# EAGLE design METEOR2K17_final (EAGLE 8.2.2)
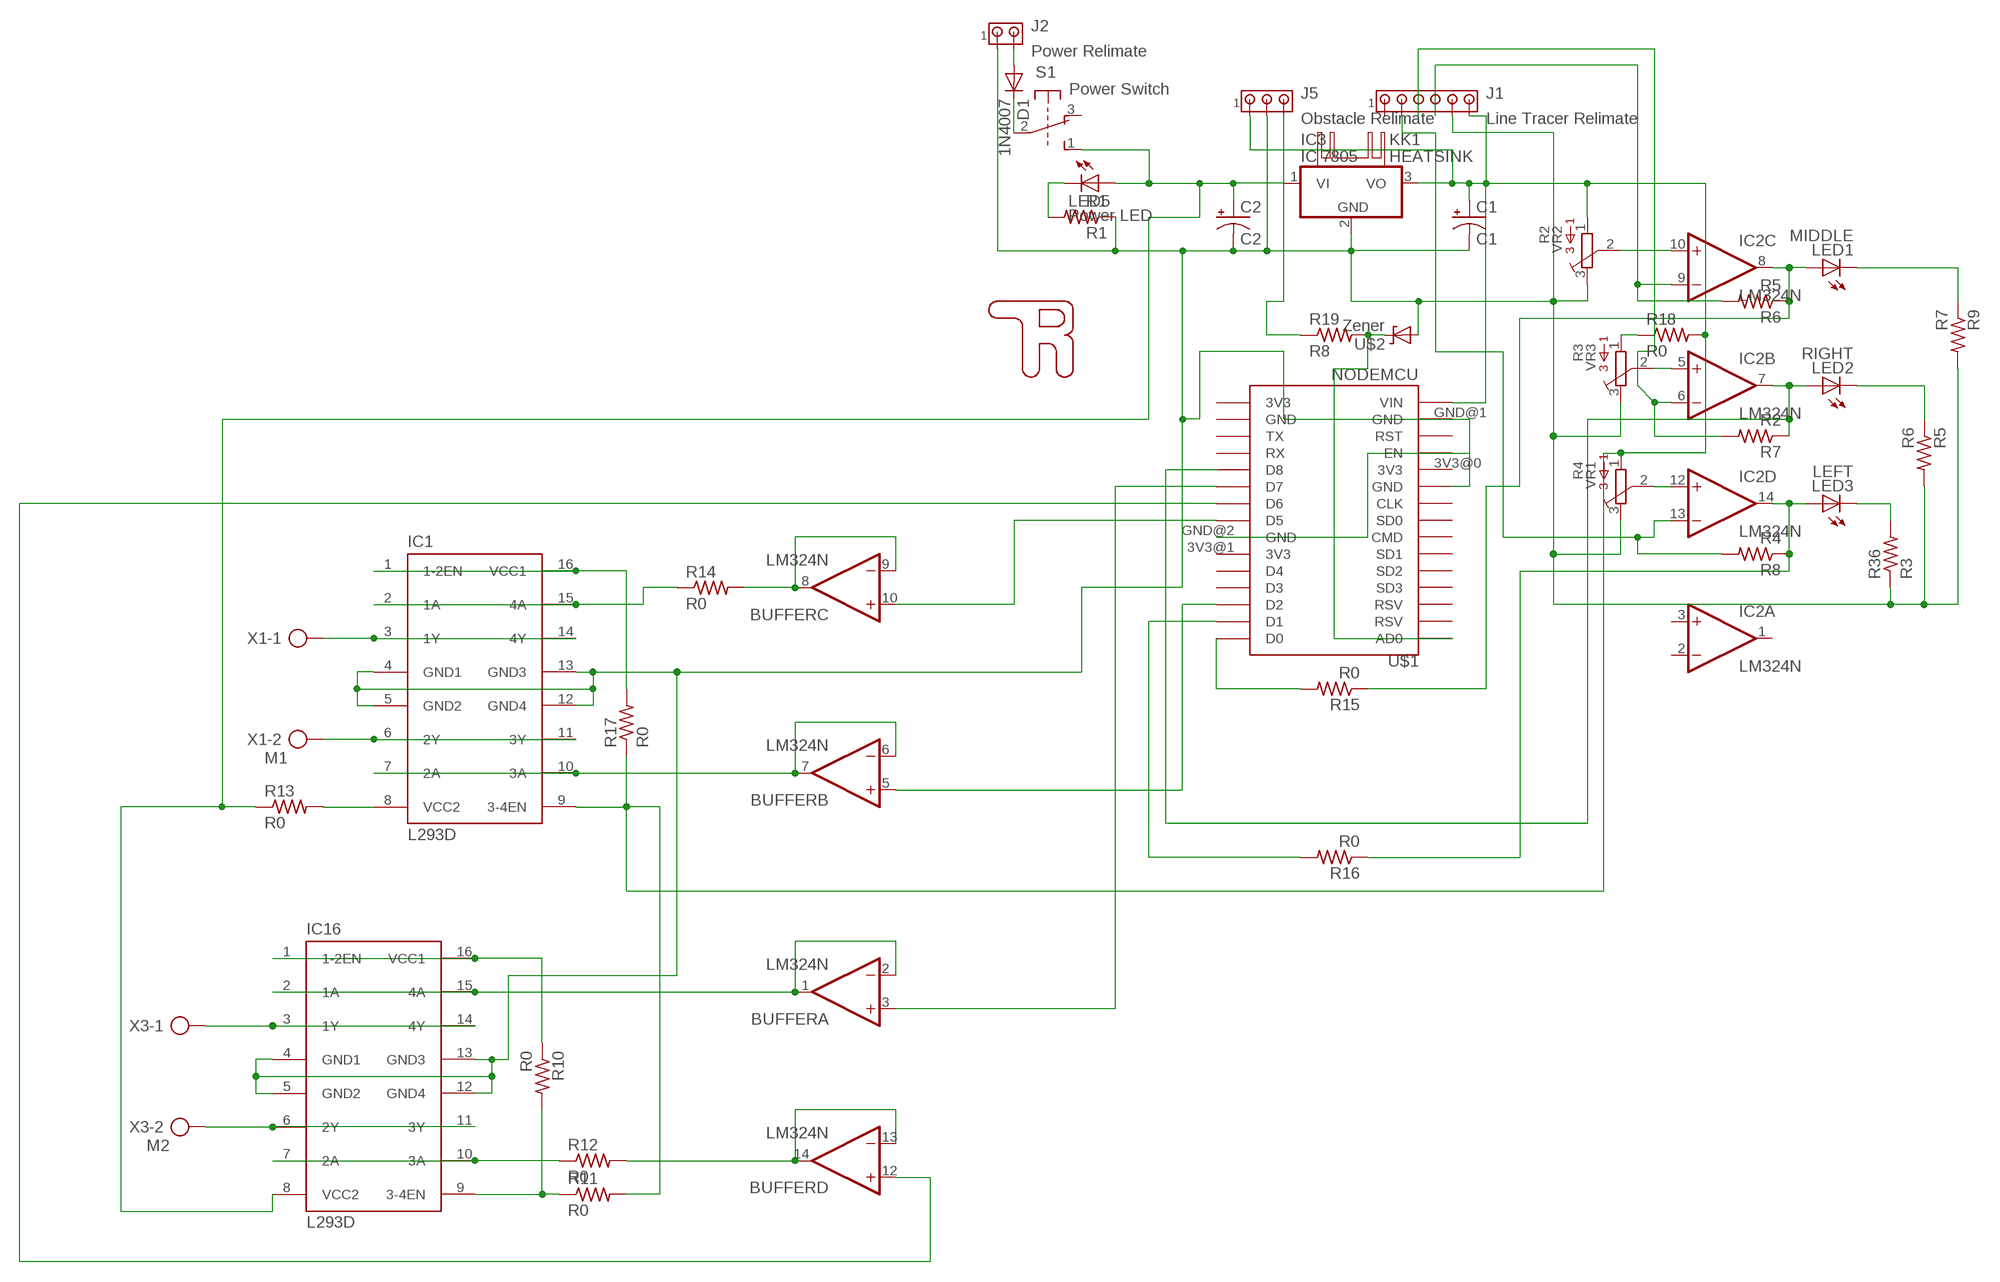
[diagram p0: schematic, sheet 1]

## Parts
BUFFER  LM324N  [DIL14]
C1  C1  1000UF-RADIAL-5MM-25V-20%  [CPOL-RADIAL-5MM-10MM]
C2  C2  CPOL-USE3.5-8  [E3,5-8]
D1  1N4007  1N4004  [DO41-10]
IC1  L293D  [DIL16]
IC2  LM324N  [DIL14]
IC3  IC 7805  7805TV  [TO220V]
IC16  L293D  [DIL16]
J1  Line Tracer Relimate  MTA06-100  [10X06MTA]
J2  Power Relimate  MTA02-100  [10X02MTA]
J5  Obstacle Relimate  MTA03-100  [10X03MTA]
KK1  HEATSINK  [HEATSINK]
LED1  MIDDLE  LED3MM  [LED3MM]
LED2  RIGHT  LED3MM  [LED3MM]
LED3  LEFT  LED3MM  [LED3MM]
LED5  Power LED  LED3MM  [LED3MM]
R1  R1  R-US_0204/7  [0204/7]
R2  VR2  3386-W  [3386W]
R3  VR3  3386-W  [3386W]
R4  VR1  3386-W  [3386W]
R5  R6  R-US_0204/7  [0204/7]
R6  R5  R-US_0204/7  [0204/7]
R7  R2  R-US_0204/7  [0204/7]
R8  R4  R-US_0204/7  [0204/7]
R9  R7  R-US_0204/7  [0204/7]
R10  R0  R-US_0204/7  [0204/7]
R11  R0  R-US_0204/7  [0204/7]
R12  R0  R-US_0207/10  [0207/10]
R13  R0  R-US_0204/7  [0204/7]
R14  R0  R-US_0207/12  [0207/12]
R15  R0  R-US_0204/7  [0204/7]
R16  R0  R-US_0204/7  [0204/7]
R17  R0  R-US_0204/7  [0204/7]
R18  R0  R-US_0204/7  [0204/7]
R19  R8  R-US_0204/7  [0204/7]
R36  R3  R-US_0204/7  [0204/7]
S1  Power Switch  9077-2  [9077-2]
U$1  NODEMCU  NODEMCU_V20  [NODEMCU_HSILK]
U$2  Zener  DIODE-ZENERPTH  [DIODE-ZENER]
U$3  TRLOGO  [TRLOGO]
X1  M1  AK300/2  [AK300/2]
X3  M2  AK300/2  [AK300/2]

## Nets
5V: C1.+ IC1.1(1-2EN) IC1.9(3-4EN) IC1.16(VCC1) IC3.3(VO) IC16.1(1-2EN) IC16.9(3-4EN) IC16.16(VCC1) J1.1 J5.1 R2.1 R4.1 R10.1 R10.2 R11.1 R11.2 R17.1 R17.2 R18.2 U$1.VIN
12V: C2.+ IC1.8(VCC2) IC3.1(VI) IC16.8(VCC2) LED5.A R13.1 R13.2 S1.1(1:S)
-LED3: LED3.K(C) R36.2
GND: C1.- C2.- IC1.4(GND1) IC1.5(GND2) IC1.12(GND4) IC1.13(GND3) IC3.2(GND) IC16.4(GND1) IC16.5(GND2) IC16.12(GND4) IC16.13(GND3) J1.2 J2.1 J5.2 R1.1 R2.3 R3.3 R4.3 R5.2 R9.2 R36.1 U$1.GND@0(GND) U$1.GND@2(GND) U$2.P$2(A)
N$1: IC2.6(B:-IN) J1.4 R7.2
N$2: D1.A J2.2
N$3: IC2.12(D:+IN) R4.2
N$4: J5.3 R19.1
N$5: IC2.7(B:OUT) LED2.A R7.1 U$1.D8
N$6: LED5.K(C) R1.2
N$7: IC1.2(1A) IC1.15(4A) R14.1
N$8: IC2.14(D:OUT) LED3.A R8.1 R16.1
N$9: IC1.3(1Y) IC1.14(4Y) X1.1
N$10: IC1.6(2Y) IC1.11(3Y) X1.2
N$11: D1.C S1.2(1:P)
N$13: R3.1 R18.1
N$15: BUFFER.6(B:-IN) BUFFER.7(B:OUT) IC1.7(2A) IC1.10(3A)
N$16: IC2.8(C:OUT) LED1.A R6.1 R15.1
N$17: R19.2 U$1.AD0 U$2.P$1(C)
N$18: BUFFER.13(D:-IN) BUFFER.14(D:OUT) R12.2
N$19: IC2.10(C:+IN) R2.2
N$20: BUFFER.10(C:+IN) U$1.D5
N$21: IC2.5(B:+IN) R3.2
N$22: BUFFER.5(B:+IN) U$1.D2
N$24: BUFFER.3(A:+IN) U$1.D7
N$25: IC16.7(2A) IC16.10(3A) R12.1
N$27: IC2.9(C:-IN) J1.3 R6.2
N$28: IC2.13(D:-IN) J1.5 R8.2
N$29: LED1.K(C) R9.1
N$30: LED2.K(C) R5.1
N$31: BUFFER.8(C:OUT) BUFFER.9(C:-IN) R14.2
N$32: IC16.3(1Y) IC16.14(4Y) X3.1
N$33: BUFFER.12(D:+IN) U$1.D6
N$34: BUFFER.1(A:OUT) BUFFER.2(A:-IN) IC16.2(1A) IC16.15(4A)
N$35: IC16.6(2Y) IC16.11(3Y) X3.2
N$36: R15.2 U$1.D0
N$37: R16.2 U$1.D1
Unconnected: IC2.1(A:OUT) IC2.2(A:-IN) IC2.3(A:+IN) J1.6 S1.3(1:O) S1.4(2:S) S1.5(2:P) S1.6(2:O) U$1.3V3@0(3V3) U$1.3V3@1(3V3) U$1.3V3@2(3V3) U$1.CLK U$1.CMD U$1.D3 U$1.D4 U$1.EN U$1.GND@1(GND) U$1.GND@3(GND) U$1.RST U$1.RSV@0(RSV) U$1.RSV@1(RSV) U$1.RX U$1.SD0 U$1.SD1 U$1.SD2 U$1.SD3 U$1.TX

## Power pins joined to a net without a drawn wire
5V: BUFFER.4(P:V+) IC2.4(P:V+)
GND: BUFFER.11(P:V-) IC2.11(P:V-)

## Library data of the parts
BUFFER IC2 = linear:LM324: OP AMP
C1 = SparkFun-Capacitors:1000UF: 1,000µF/1mF ceramic capacitors A capacitor is a passive two-terminal electrical component used to store electrical energy temporarily in an electric field. CAP-08070; PROD_ID: CAP-09538; VALUE: 1mF
C2 = adafruit:CPOL-US: POLARIZED CAPACITOR, American symbol
D1 = adafruit:1N4004: DIODE General purpose 1N400x type rectifier (With bigger pads) http://www.ladyada.net/library/pcb/eaglelibrary.html
IC1 IC16 = st-microelectronics:L293D: PUSH-PULL 4 CHANNEL DRIVER; MPN: L293D; OC_FARNELL: 9589619; OC_NEWARK: 56P8249
IC3 = linear:78*: Positive VOLTAGE REGULATOR Source: http://cache.national.com/ds/LM/LM78L05.pdf http://www.fairchildsemi.com/ds/LM/LM7805.pdf
J1 = con-amp:MTA06-100: AMP connector
J2 = con-amp:MTA02-100: AMP connector
J5 = con-amp:MTA03-100: AMP connector
KK1 = heatsink:HEATSINK: Made by Aniruddha Damle (TRSKNCOE)
LED1-LED3 LED5 = adafruit:LED: LED OSRAM: - CHIPLED LG R971, LG N971, LY N971, LG Q971, LY Q971, LO R971, LY R971 LH N974, LH R974 LS Q976, LO Q976, LY Q976 LO Q996 - Hyper CHIPLED LW Q18S LB Q993, LB Q99A, LB R99A - SideLED LS A670, LO A670, LY A670, LG A670, LP A670 LB A673, LV A673, LT A673, LW A673 LH A674 LY A675 LS A676, LA A676, LO A676, LY A676, LW A676 LS A679, LY A679, LG A679 - Hyper Micro SIDELED® LS Y876, LA Y876, LO Y876, LY Y876 LT Y87S - SmartLED LW L88C, LW L88S LB L89C, LB L89S, LG L890 LS L89K, LO L89K, LY L89K LS L896, LA L896, LO L896, LY L896 - TOPLED LS T670, LO T670, LY T670, LG T670, LP T670 LSG T670, LSP T670, LSY T670, LOP T670, LYG T670 LG T671, LOG T671, LSG T671 LB T673, LV T673, LT T673, LW T673 LH T674 LS T676, LA T676, LO T676, LY T676, LB T676, LH T676, LSB T676, LW T676 LB T67C, LV T67C, LT T67C, LS T67K, LO T67K, LY T67K, LW E67C LS E67B, LA E67B, LO E67B, LY E67B, LB E67C, LV E67C, LT E67C LW T67C LS T679, LY T679, LG T679 LS T770, LO T770, LY T770, LG T770, LP T770 LB T773, LV T773, LT T773, LW T773 LH T774 LS E675, LA E675, LY E675, LS T675 LS T776, LA T776, LO T776, LY T776, LB T776 LHGB T686 LT T68C, LB T68C - Hyper Mini TOPLED® LB M676 - Mini TOPLED Santana® LG M470 LS M47K, LO M47K, LY M47K Source: http://www.osram.convergy.de/
R1 R5-R19 R36 = adafruit:R-US_: RESISTOR, American symbol
R2-R4 = bourns:3386-: 3386 Series 3/8" Square Trimmer
S1 = switch-misc:9077-2: MARQUARDT SWITCH 9077.0200 Distributor: Buerklin <https://www.buerklin.com/default.asp?event=ShowArtikel%2812G2822%29&l=d&jump=ArtNr_12G2822>
U$1 = NODEMCU:NODEMCU_V2
U$2 = SparkFun:DIODE-ZENER: Zener Diode Production Part - 8199 3.4V Zener Voltage
U$3 = TRLOGO:TRLOGO
X1 X3 = con-ptr500:AK300/2: CONNECTOR; OC_FARNELL: unknown; OC_NEWARK: unknown

## Board
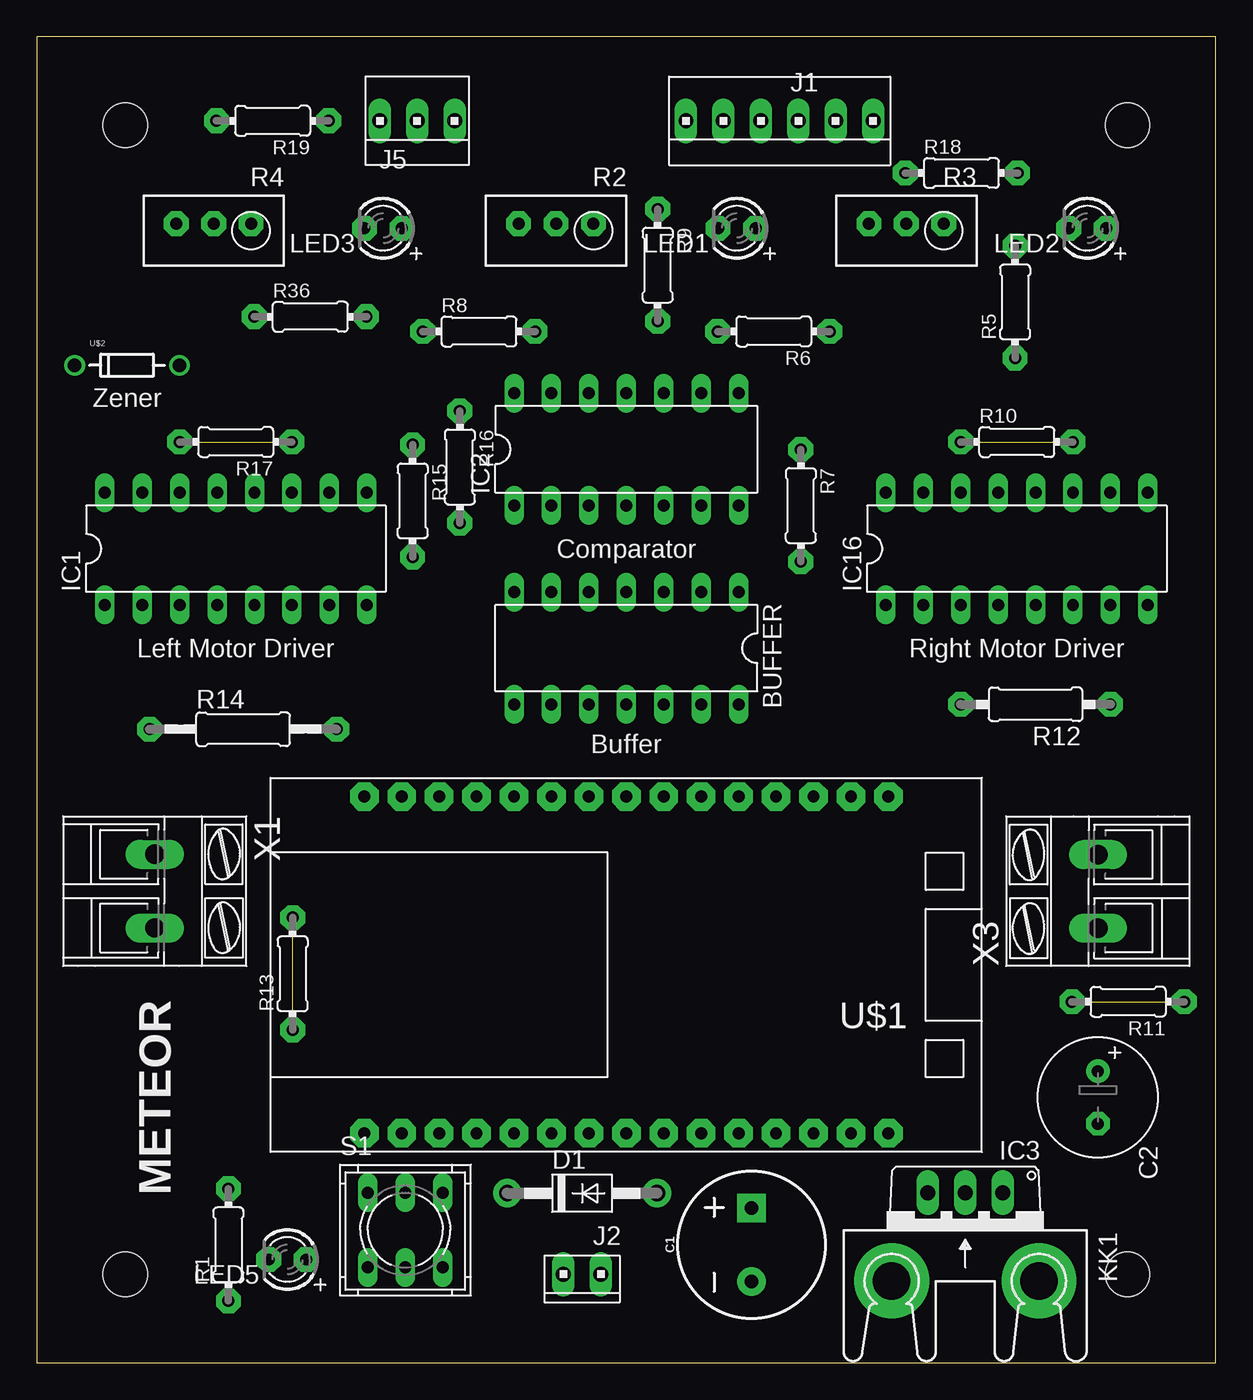
[diagram p1: board, top side]
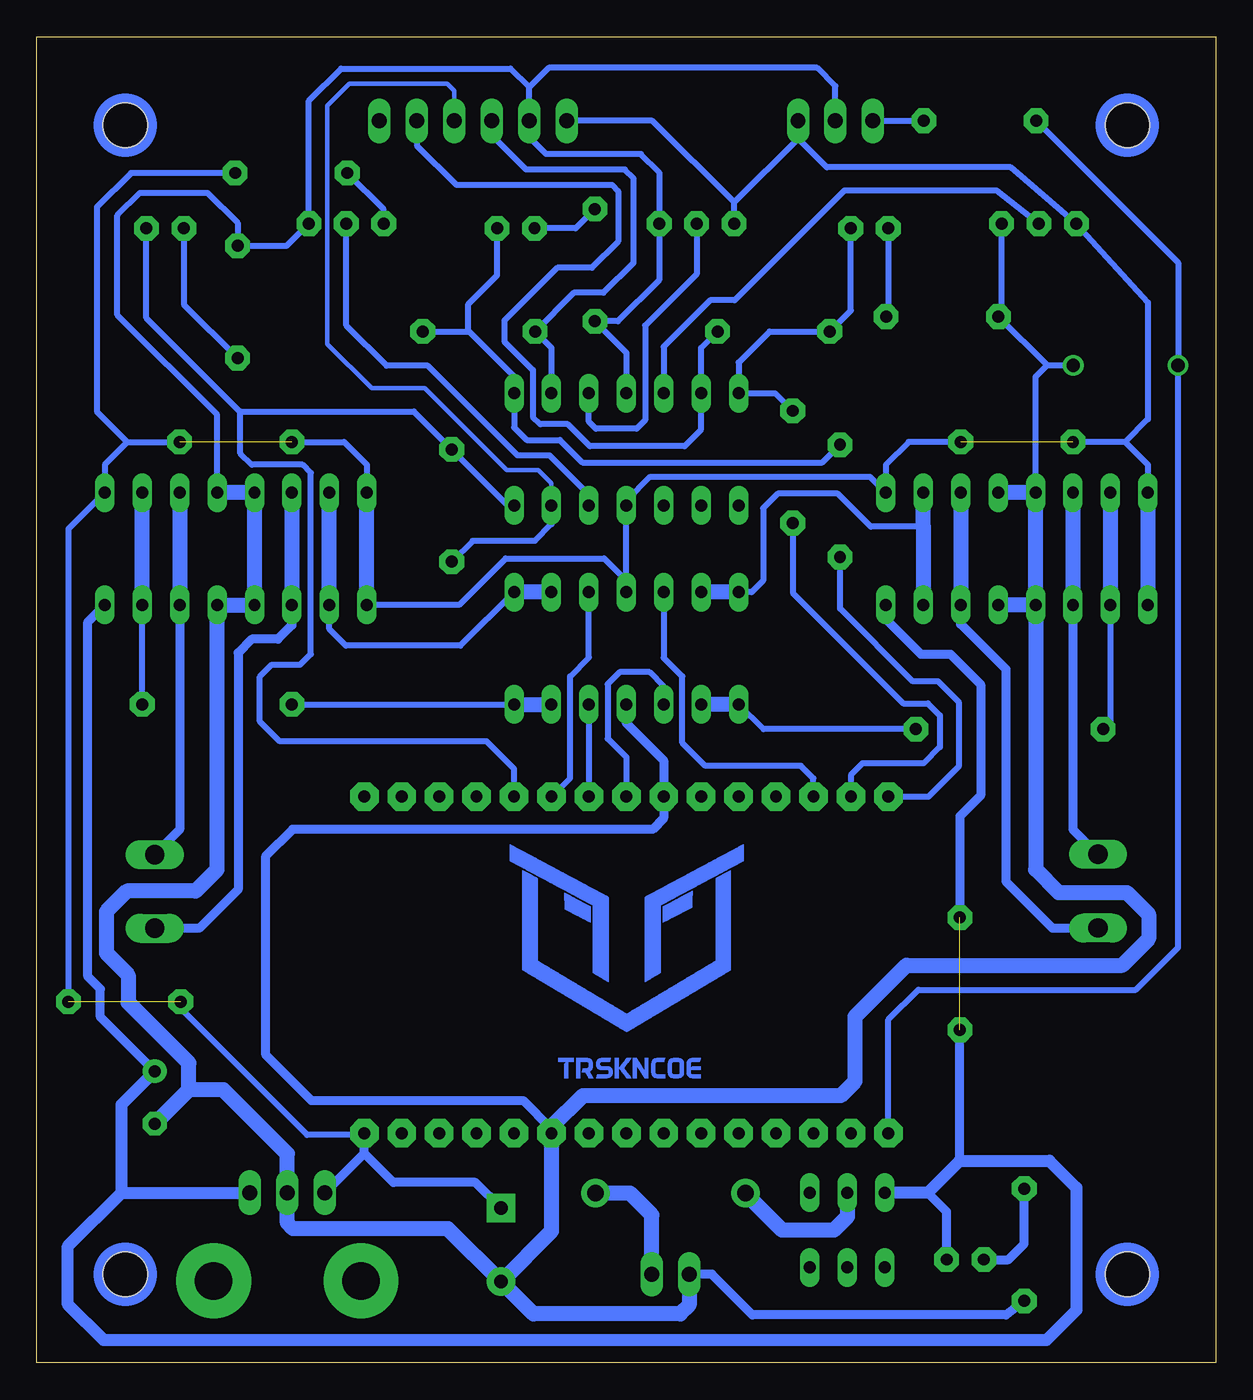
[diagram p2: board, bottom side, seen from below]

Size 80 x 90 mm. Coordinates in mm from the lower left corner, seen from the top.
Outline: 0,0 80,0 80,90 0,90 0,0
Copper layers (1*16): Top 0.035mm / dielectric 1.5mm / Bottom 0.035mm
Design rules "default *": minimum track width 10mil, minimum drill 24mil, track to track 8mil, track to pad 6mil, pad to pad 8mil, via to via 8mil, smd to smd 8mil, copper to edge 40mil, drill to drill 8mil, minimum pad ring 10mil, minimum via ring 8mil, stop-mask expansion 4mil, vias tented up to drill 0mil, thermal gap 10mil
Holes 3 mm at 6,84 74,84 74,6 6,6

### Footprints (pad centres in the part's own frame; a part is rotated, then mirrored left to right if it is on the bottom)
DIL14 = drill 0.813 long: 1 -7.62,-3.81; 2 -5.08,-3.81; 3 -2.54,-3.81; 4 0,-3.81; 5 2.54,-3.81; 6 5.08,-3.81; 7 7.62,-3.81; 8 7.62,3.81; 9 5.08,3.81; 10 2.54,3.81; 11 0,3.81; 12 -2.54,3.81; 13 -5.08,3.81; 14 -7.62,3.81
CPOL-RADIAL-5MM-10MM = drill 0.9 pad 1.93 square: + 2.5,0 | drill 0.9 pad 1.93: - -2.5,0
E3,5-8 = drill 0.813 pad 1.6: + -1.778,0 | drill 0.813 pad 1.6 octagon: - 1.778,0
DO41-10 = drill 1.118 pad 1.93: A 5.08,0; C -5.08,0
DIL16 = drill 0.813 long: 1 -8.89,-3.81; 2 -6.35,-3.81; 3 -3.81,-3.81; 4 -1.27,-3.81; 5 1.27,-3.81; 6 3.81,-3.81; 7 6.35,-3.81; 8 8.89,-3.81; 9 8.89,3.81; 10 6.35,3.81; 11 3.81,3.81; 12 1.27,3.81; 13 -1.27,3.81; 14 -3.81,3.81; 15 -6.35,3.81; 16 -8.89,3.81
TO220V = drill 1.016 long: 1 -2.54,-2.54; 2 0,-2.54; 3 2.54,-2.54
10X06MTA = drill 1.016 long: 1 6.35,0; 2 3.81,0; 3 1.27,0; 4 -1.27,0; 5 -3.81,0; 6 -6.35,0
10X02MTA = drill 1.016 long: 1 1.27,0; 2 -1.27,0
10X03MTA = drill 1.016 long: 1 2.54,0; 2 0,0; 3 -2.54,0
HEATSINK = drill 2.54 pad 5.08: A2,5 -5,3.45; B2,5 5,3.45
LED3MM = drill 0.813 pad 1.676 octagon: A -1.27,0; K 1.27,0
0204/7 = drill 0.813 pad 1.676 octagon: 1 -3.81,0; 2 3.81,0
3386W = drill 0.813 pad 1.676 octagon: 1 2.54,-0.318; 2 0,-0.318; 3 -2.54,-0.318
0207/10 = drill 0.813 pad 1.676 octagon: 1 -5.08,0; 2 5.08,0
0207/12 = drill 0.813 pad 1.676 octagon: 1 -6.35,0; 2 6.35,0
9077-2 = drill 0.813 long: 1 -2.54,2.54; 2 0,2.54; 3 2.54,2.54; 4 -2.54,-2.54; 5 0,-2.54; 6 2.54,-2.54
NODEMCU_HSILK = drill 0.8 pad 1.93 octagon: 3V3@0 -11.43,-7.62; 3V3@1 11.43,5.08; 3V3@2 11.43,-17.78; AD0 -11.43,17.78; CLK -11.43,-2.54; CMD -11.43,2.54; D0 11.43,17.78; D1 11.43,15.24; D2 11.43,12.7; D3 11.43,10.16; D4 11.43,7.62; D5 11.43,0; D6 11.43,-2.54; D7 11.43,-5.08; D8 11.43,-7.62; EN -11.43,-10.16; GND@0 -11.43,-5.08; GND@1 -11.43,-15.24; GND@2 11.43,2.54; GND@3 11.43,-15.24; RST -11.43,-12.7; RSV@0 -11.43,15.24; RSV@1 -11.43,12.7; RX 11.43,-10.16; SD0 -11.43,0; SD1 -11.43,5.08; SD2 -11.43,7.62; SD3 -11.43,10.16; TX 11.43,-12.7; VIN -11.43,-17.78
DIODE-ZENER = drill 0.9: P$1 -3.556,0; P$2 3.556,0
AK300/2 = drill 1.321 long: 1 -2.515,0; 2 2.489,0

### Placement (x,y rotation side)
BUFFER  40,48.5 180 top
C1  48.5,8 90 top
C2  72,18 270 top
D1  37,11.5 0 top
IC1  13.5,55.25 0 top
IC2  40,62 0 top
IC3  63,9 180 top
IC16  66.5,55.25 0 top
J1  50.4,84.3 180 top
J2  37,6 180 top
J5  25.81,84.3 0 top
KK1  63,9 180 top
LED1  47.5,77 180 top
LED2  71.29,77 180 top
LED3  23.5,77 180 top
LED5  17,7 180 top
R1  13,8 90 top
R2  35.23,77 180 top
R3  59,77 180 top
R4  12,77 180 top
R5  66.38,72 90 top
R6  50,70 180 top
R7  51.84,58.18 270 top
R8  30,70 0 top
R9  42.13,74.5 270 top
R10  66.5,62.5 0 top
R11  74.05,24.5 180 top
R12  67.77,44.69 180 top
R13  17.36,26.4 90 top
R14  14,43 0 top
R15  25.5,58.5 270 top
R16  28.7,60.8 270 top
R17  13.5,62.5 180 top
R18  62.74,80.76 0 top
R19  16,84.3 180 top
R36  18.56,71 0 top
S1  25,9 0 top
U$1  40,27 90 top
U$2  6.12,67.7 0 top
U$3  40,27.25 0 top
X1  8,32 270 top
X3  72,32 90 top

### Tracks (layer width: path | path; a pad name or v marks a point on that pad's centre or on a via)
5V  (3 unrouted)
  Bottom 0.406: IC2.4 40,53.1 41.5,54.6 48.19,54.6 51.35,51.44 IC16.1 | 28.35,83.1 26.39,81.14 13.92,81.14 R4.1 4.61,71.98 4.61,64.04 6.15,62.5 | IC16.16 57.61,60.96 59.15,62.5 R10.1 | R11.1 77.86,56.59 IC16.9 75.39,60.96 73.85,62.5 | R18.2 73.6,80.76 75.92,78.44 75.92,64.57 73.85,62.5 | 40,58.5 38.36,60.14 23.47,60.14 IC1.9 22.39,60.96 20.85,62.5 R17.1 | 57.78,15.46 61.66,15.46 70.24,24.04 R11.2 | 73.85,62.5 R10.2 | 6.15,62.5 R17.2 | 6.15,62.5 4.61,60.96 IC1.16 | J5.1 28.35,83.1 | R2.1 32.69,78.76 | 28.35,83.1 32.69,78.76 | 32.69,78.76 38.23,84.3 J1.1
  Bottom 0.61: 57.78,14.22 57.78,15.46 U$1.VIN | IC3.3 57.78,14.22 | C1.+ 50.24,12.24 55.8,12.24 57.78,14.22 | 40,53.1 BUFFER.4 | 40,59.11 IC2.4 40,58.5 | 28.35,83.1 J5.1
  Bottom 1.016: IC1.16 IC1.1 | IC16.1 IC16.16
12V  (1 unrouted)
  Bottom 0.61: 74.28,11.54 74.26,11.54 | LED5.A 18.27,10.25 19.56,11.54 | 17.38,13.72 17.36,13.74 R13.1 | IC16.8 76.54,50.29 76.54,26.21 75.69,25.36 75.69,23.47 C2.+ | IC1.8 22.39,50.47 20,48.08 17.99,48.08 15.96,46.05 15.96,38.49 17.36,37.09 R13.2
  Bottom 0.813: S1.1 19.56,11.54 17.38,13.72 11.3,13.72 9.46,11.88 9.46,3.56 11.5,1.52 75.47,1.52 77.89,3.94 77.89,7.93 74.28,11.54 | IC3.1 74.26,11.54 74.26,17.51 C2.+
  Bottom 1.016: IC3.1 65.52,11.52
-LED3
  Bottom 0.406: LED3.K 22.23,71.14 R36.2
GND
  Bottom 0.406: 46.59,86.58 J1.2 46.59,83.19 45.44,82.04 39.01,82.04 37.77,80.8 R2.3 37.77,73.5 40.58,70.69 R9.2 40,68.56 IC2.11 | 46.59,86.58 45.28,87.89 27.05,87.89 25.81,86.65 J5.2 25.81,83.22 | 46.59,86.58 47.86,87.85 59.35,87.85 61.54,85.66 R3.3 63.05,75.81 R5.2 66.38,77.38 68.42,79.42 72.99,79.42 74.53,77.88 74.53,71.11 67.77,64.35 IC16.12 | R4.3 14.54,71.21 R36.1 | 14.77,70.98 R36.1 | R36.1 arc-90 14.77,70.98 | IC1.12 arc-90 IC1.12 | 11.45,67.7 R36.1 | 11.45,67.7 U$2.P$2 | IC1.13 12.23,66.92 11.45,67.7
  Bottom 0.61: R1.1 14.22,3.25 31.44,3.25 34.19,6 J2.1 | BUFFER.11 40,43.42 37.46,40.88 U$1.GND@2 37.46,36.96 38.22,36.2 62.65,36.2 64.45,34.4 64.45,20.88 61.37,17.8 47.01,17.8 45.08,15.88
  Bottom 0.813: 45.08,15.99 45.08,15.88 U$1.GND@0
  Bottom 1.016: J2.1 35.73,3.91 36.33,3.31 46.31,3.31 C1.- | IC1.4 IC1.13 IC1.12 | IC1.4 IC1.5 | C1.- 45.08,8.92 U$1.GND@0 | 45.08,15.99 42.95,18.12 25.46,18.12 24.47,19.11 24.47,23.5 20.99,26.98 6.34,26.98 4.55,28.77 4.55,30.43 6.04,31.92 10.68,31.92 12.23,33.47 IC1.4 | 69.69,18.53 69.69,20.34 73.8,24.45 73.8,26.32 75.28,27.8 75.28,30.63 73.89,32.02 69.23,32.02 67.77,33.48 IC16.5 IC16.4 IC16.13 IC16.12 | 69.69,18.53 C2.- | 69.69,18.53 67.34,18.53 63,14.19 IC3.2 63,9.48 62.62,9.1 52.1,9.1 C1.-
N$1
  Bottom 0.305: J1.4 51.67,86.34 52.14,86.81 58.81,86.81 60.28,85.34 60.28,69.13 57.29,66.14 53.69,66.14 48.13,60.58 45.96,60.58 45.08,59.7 IC2.6
  Bottom 0.406: IC2.6 45.08,56.91 46.21,55.78 50.43,55.78 R7.2
N$2
  Bottom 1.016: J2.2 38.27,10.02 39.75,11.5 D1.A
N$3
  Bottom 0.406: R4.2 14.88,79.56 25.21,79.56 32.65,72.12 34.31,72.12 37.46,68.97 IC2.12
N$4
  Bottom 0.406: J5.3 R19.1
N$5
  Bottom 0.406: LED2.A 72.56,70.91 66.22,64.57 66.18,64.57 | R7.1 51.88,61.99 51.87,61.98 | R7.1 54.42,64.57 66.18,64.57 | U$1.D8 47.62,40.31 49.48,42.17 63.51,42.17 64.86,43.52 64.86,46.57 64.05,47.38 62.13,47.38 61.41,48.1 61.41,60.39 61.97,60.95 65.41,60.95 66.18,61.72 66.18,64.57 | R7.1 48.04,58.19 IC2.7
N$6
  Bottom 0.61: R1.2 13,8.07 14.07,7 LED5.K
N$7
  Bottom 0.406: IC1.2 7.15,43.5 R14.1
  Bottom 1.016: IC1.15 IC1.2
N$8
  Bottom 0.406: R16.1 29.9,65.81 IC2.14 32.38,67.9 30.28,70 R8.1 24.77,71.42 LED3.A
N$9
  Bottom 0.61: IC1.3 9.69,36.2 X1.1
  Bottom 1.016: IC1.14 IC1.3
N$10
  Bottom 0.61: X1.2 11.09,29.51 14.25,32.67 14.25,47.08 17.31,50.14 IC1.6
  Bottom 1.016: IC1.11 IC1.6
N$11
  Bottom 1.016: S1.2 25,9.91 25.91,9 29.42,9 D1.C
N$13
  Bottom 0.406: R3.1 56.46,78.29 R18.1
N$15
  Bottom 0.406: 19.85,56.74 19.86,56.74 23.4,56.74 25.65,58.99 29.73,58.99 30.72,58 30.72,53.08 31.49,52.31 BUFFER.7
  Bottom 1.016: IC1.7 19.85,56.74 IC1.10 | BUFFER.7 BUFFER.6
N$16
  Bottom 0.406: R6.1 50.71,70 | 50.71,70 50.7,70.01 47.62,66.93 IC2.8 47.62,63.49 46.76,62.63 44.51,62.63 42.99,61.11 26.7,61.11 R15.1 | 50.71,70 50.71,71.87 48.77,73.81 LED1.A
N$17
  Bottom 0.406: U$1.AD0 22.22,23.29 20.19,25.32 5.42,25.32 2.56,28.18 U$2.P$1 2.56,74.67 R19.2
N$18
  Bottom 0.406: R12.2 BUFFER.14
  Bottom 1.016: BUFFER.14 BUFFER.13
N$19
  Bottom 0.406: R2.2 35.23,73.89 38.72,70.4 38.72,63.98 39.3,63.4 42.07,63.4 42.54,63.87 IC2.10
N$20
  Bottom 0.406: BUFFER.10 37.46,45.91 38.42,46.87 40.45,46.87 41.26,46.06 41.26,42.37 40,41.11 U$1.D5
N$21
  Bottom 0.406: R3.2 59,70.4 56.27,67.67 53.46,67.67 47.38,61.59 45.21,61.59 42.54,58.92 IC2.5
N$22
  Bottom 0.406: BUFFER.5 37.46,47.85 36.2,46.59 36.2,42.08 34.63,40.51 28.15,40.51 27.3,39.66 U$1.D2
N$24
  Bottom 0.406: U$1.D7 43.82,39.69 43.82,46.59 42.54,47.87 BUFFER.3
N$25
  Bottom 0.406: R12.1 IC16.7
  Bottom 1.016: IC16.7 IC16.10
N$27
  Bottom 0.406: J1.3 49.13,83.32 46.8,80.99 40.1,80.99 39.5,80.39 39.5,74.67 41.55,72.62 43.57,72.62 R6.2 45.08,68.89 IC2.9
N$28
  Bottom 0.406: R8.2 34.92,68.89 IC2.13 34.92,63.34 36.05,62.21 42.48,62.21 43.97,63.7 45.84,63.7 46.34,64.2 46.34,67.39 48.27,69.32 48.27,70.74 44.68,74.33 42.33,74.33 40.55,76.11 40.55,79.53 40.97,79.95 51.54,79.95 54.21,82.62 J1.5
N$29
  Bottom 0.406: R9.1 43.44,77 LED1.K
N$30
  Bottom 0.406: LED2.K 70.02,71.83 R5.1
N$31
  Bottom 0.406: R14.2 30.69,43 BUFFER.8
  Bottom 1.016: BUFFER.8 BUFFER.9
N$32
  Bottom 0.61: IC16.3 62.69,50.07 63.64,49.12 65.41,49.12 66.35,48.18 66.35,32.12 68.98,29.48 X3.1
  Bottom 1.016: IC16.14 IC16.3
N$33
  Bottom 0.406: BUFFER.12 U$1.D6
N$34
  Bottom 0.406: BUFFER.1 51.26,48.67 59.03,48.67 60.15,49.79 IC16.2
  Bottom 1.016: IC16.2 IC16.15 | BUFFER.2 BUFFER.1
N$35
  Bottom 0.61: IC16.6 70.31,36.18 X3.2
  Bottom 1.016: IC16.11 IC16.6
N$36
  Bottom 0.406: U$1.D0 19.49,38.43 17.41,40.51 17.41,44.81 18.85,46.25 20.56,46.25 25.5,51.19 R15.2
N$37
  Bottom 0.406: R16.2 28.7,52.25 21.21,44.76 19.54,44.76 18.72,43.94 18.72,41.78 19.82,40.68 23.98,40.68 24.77,39.89 U$1.D1
(copper drawn outside any net)
  shapes: Bottom circle x4

### Text on the board
tPlace: Comparator | Left Motor Driver | Right Motor Driver | Buffer | METEOR